# Altium schematic sheet CSP_inFET_withThermometer.SchDoc
size A4; DocumentNumber: 3; SheetNumber: 3; SheetTotal: 4
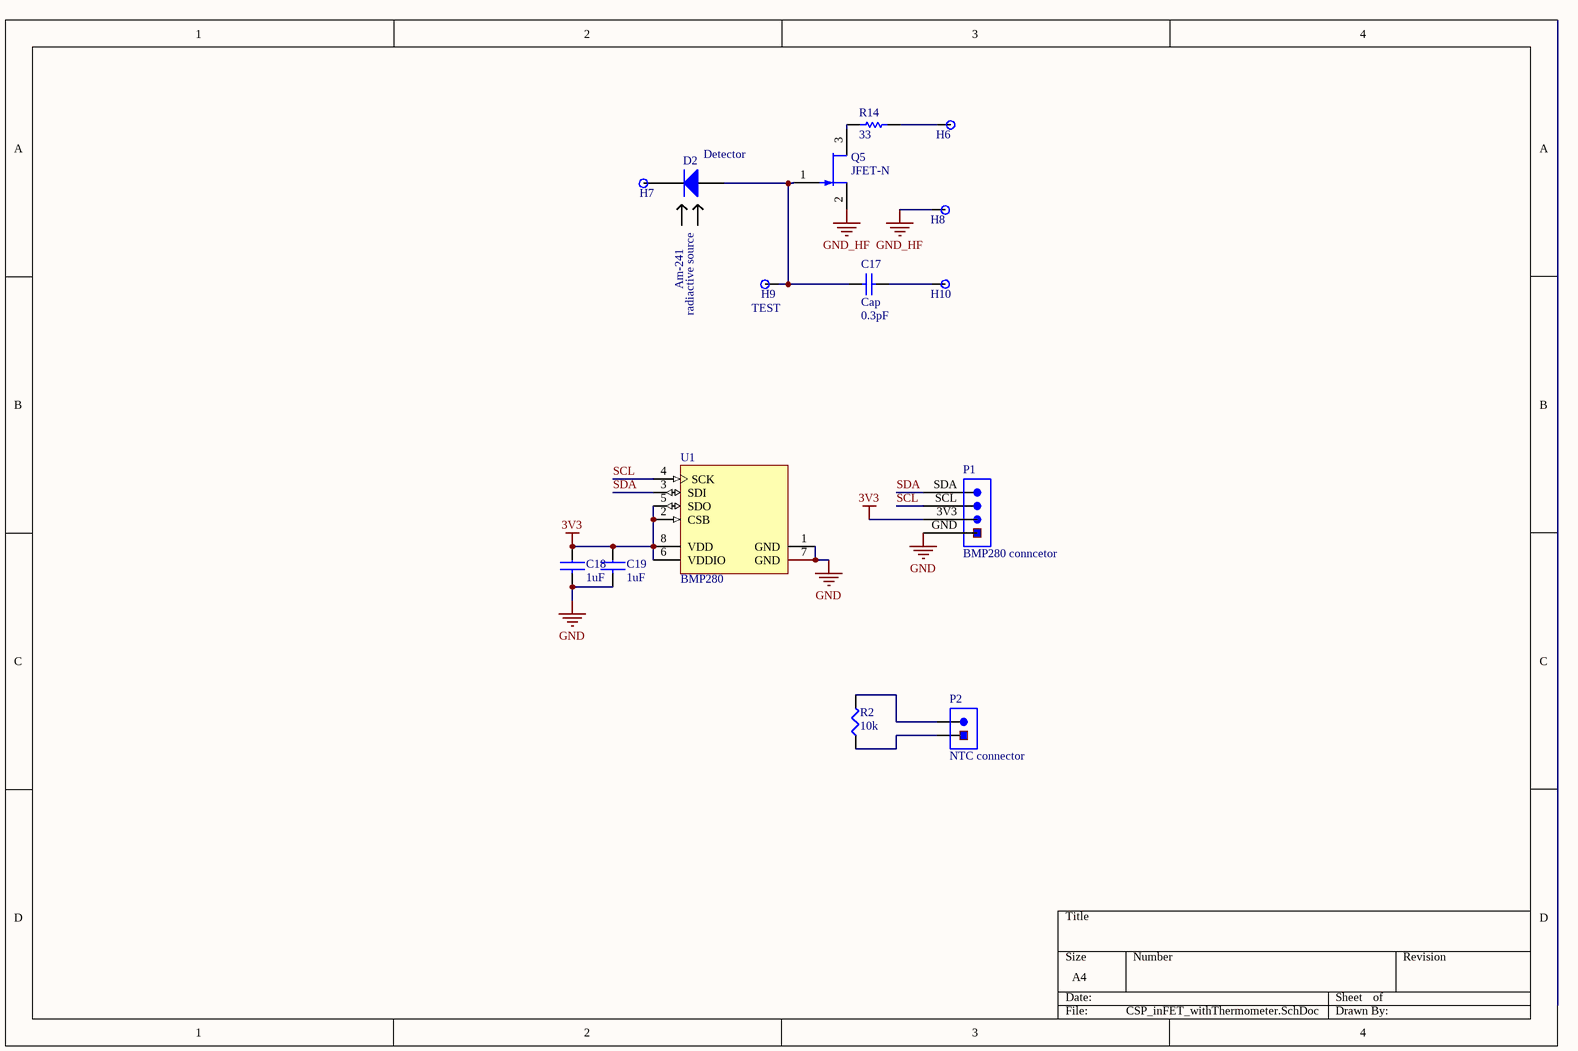
[diagram p0: CSP_inFET_withThermometer.SchDoc]

## Parts
C17  Cap  value 0.3pF  [CAPC160X80X90L35N]
C18  1uF  [CAPC160X80X90L35N]
C19  1uF  [CAPC160X80X90L35N]
D2  Detector  [Detector]
H6  PAD  [PAD_rounded]  (value not drawn)  (no BOM)
H7  PAD  [PAD_rounded]  (value not drawn)  (no BOM)
H8  PAD  [PAD_rounded]  (value not drawn)  (no BOM)
H9  TEST  [PAD_rounded]  (no BOM)
H10  PAD  [PAD_rounded]  (value not drawn)  (no BOM)
P1  BMP280 conncetor  [FOUR PADS]
P2  NTC connector  [TWO PADS - small]
Q5  JFET-N  [SOT23-3P95_240X114L20X40N]
R2  10k  [RESC200X125X70L40N]
R14  33  [RESC200X125X70L40N]
U1  BMP280  [BOSC-LGA-8_V]

## Nets
3V3: C18.1 C19.1 P1.3V3 U1.2(CSB) U1.5(SDO) U1.6(VDDIO) U1.8(VDD)
GND: C18.2 C19.2 P1.GND U1.1(GND) U1.7(GND)
GND_HF: H8.1 Q5.2(S)
SCL: P1.SCL U1.4(SCK)
SDA: P1.SDA U1.3(SDI)
NetC17_1: C17.1 H10.1
NetC17_2: C17.2 D2.A H9.1 Q5.1(G)
NetD2_C: D2.C H7.1
NetH6_1: H6.1 R14.2
NetP2_1: P2.1 R2.2
NetP2_2: P2.2 R2.1
NetQ5_3: Q5.3(D) R14.1

## Notes on the sheet
- Am-241
- radiactive source

## Library data of the parts
C17 = Cap: Capacitor; Published: 8-Jun-2000; LatestRevisionDate: 17-Jul-2002; LatestRevisionNote: Re-released for DXP Platform.; PackageReference: RAD-0.3; Publisher: Altium Limited; PackageDescription: Radial Cap, Thru-Hole; 2 Leads; 0.3 in Pin Spacing; LCSC Part #: *
C18 C19 = capacitor: Value: 1uF
D2 = Diode
H9 = PAD
P1 = PADS for BMP: Value: 1uF
P2 = TWO PADS: Value: 1uF
Q5 = JFET-N: N-Channel JFET; Published: 8-Jun-2000; LatestRevisionDate: 17-Jul-2002; LatestRevisionNote: Re-released for DXP Platform.; PackageReference: TO-254-AA; Publisher: Altium Limited; Code_JEDEC: TO-254-AA; LCSC Part #: *
R2 = Resistor: Value: 10k; Part Number: *; LCSC Part #: *; Package: *
R14 = Res1: Resistor; Published: 8-Jun-2000; LatestRevisionDate: 17-Jul-2002; LatestRevisionNote: Re-released for DXP Platform.; PackageReference: AXIAL-0.3; Publisher: Altium Limited; PackageDescription: Axial Device, Thru-Hole; 2 Leads; 0.3 in Pin Spacing; Value: 33; LCSC Part #: *
U1 = BMP280: Digital Pressure Sensor, 1.71 to 3.6 V, -40 to 85 degC, 8-Pin LGA, RoHS, Tape and Reel; Manufacturer: Bosch Sensortec; Manufacturer name: Bosch; Manufacturer URL: http://www.bosch-sensortec.com; Datasheet URL: http://datasheet.octopart.com/BMP280-Bosch-datasheet-41546027.pdf; Datasheet Version: Rev. 1.14, 05/2015; Part Number: BMP280; Manufacturer: Bosch; Manufacturer Part Number: BMP280